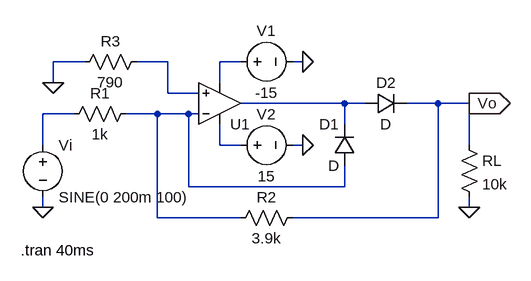
[diagram p0: schematic Run_1.asc]
Run_1.asc, the LTspice schematic file:
Version 4
SHEET 1 880 680
WIRE 80 32 32 32
WIRE 208 32 160 32
WIRE 320 32 288 32
WIRE 416 32 400 32
WIRE 32 64 32 32
WIRE 288 64 288 32
WIRE 208 80 208 32
WIRE 256 80 208 80
WIRE 480 96 320 96
WIRE 512 96 480 96
WIRE 624 96 576 96
WIRE 672 96 624 96
WIRE 64 112 16 112
WIRE 192 112 144 112
WIRE 240 112 192 112
WIRE 256 112 240 112
WIRE 480 128 480 96
WIRE 16 160 16 112
WIRE 288 160 288 128
WIRE 320 160 288 160
WIRE 416 160 400 160
WIRE 672 160 672 96
WIRE 240 224 240 112
WIRE 480 224 480 192
WIRE 480 224 240 224
WIRE 16 256 16 240
WIRE 672 256 672 240
WIRE 192 272 192 112
WIRE 320 272 192 272
WIRE 624 272 624 96
WIRE 624 272 400 272
FLAG 416 32 0
FLAG 416 160 0
FLAG 16 256 0
FLAG 32 64 0
FLAG 672 256 0
FLAG 672 96 Vo
IOPIN 672 96 Out
SYMBOL OpAmps\\UniversalOpamp2 288 96 M180
SYMATTR InstName U1
SYMBOL voltage 304 32 R270
WINDOW 0 32 56 VTop 2
WINDOW 3 -32 56 VBottom 2
WINDOW 123 0 0 Left 0
WINDOW 39 0 0 Left 0
SYMATTR InstName V1
SYMATTR Value -15
SYMBOL voltage 304 160 R270
WINDOW 0 32 56 VTop 2
WINDOW 3 -32 56 VBottom 2
WINDOW 123 0 0 Left 0
WINDOW 39 0 0 Left 0
SYMATTR InstName V2
SYMATTR Value 15
SYMBOL diode 496 192 R180
WINDOW 0 24 64 Left 2
WINDOW 3 24 0 Left 2
SYMATTR InstName D1
SYMBOL diode 512 112 R270
WINDOW 0 32 32 VTop 2
WINDOW 3 0 32 VBottom 2
SYMATTR InstName D2
SYMBOL res 416 256 R90
WINDOW 0 0 56 VBottom 2
WINDOW 3 32 56 VTop 2
SYMATTR InstName R2
SYMATTR Value 3.9k
SYMBOL res 160 96 R90
WINDOW 0 0 56 VBottom 2
WINDOW 3 32 56 VTop 2
SYMATTR InstName R1
SYMATTR Value 1k
SYMBOL voltage 16 144 R0
WINDOW 123 0 0 Left 0
WINDOW 39 0 0 Left 0
SYMATTR InstName Vi
SYMATTR Value SINE(0 200m 100)
SYMBOL res 176 16 R90
WINDOW 0 0 56 VBottom 2
WINDOW 3 32 56 VTop 2
SYMATTR InstName R3
SYMATTR Value 790
SYMBOL res 656 144 R0
SYMATTR InstName RL
SYMATTR Value 10k
TEXT -18 322 Left 2 !.tran 40ms

The netlist it stands for:
* Run_1.asc
XU1 N001 N005 N006 N002 N003 level.2 Avol=1Meg GBW=10Meg Slew=10Meg ilimit=25m rail=0 Vos=0 phimargin=45 en=0 enk=0 in=0 ink=0 Rin=500Meg  ; pins IN+ IN- V+ V- OUT
V1 N002 0 -15
V2 N006 0 15
D1 N005 N003 D
D2 N003 Vo D
R2 Vo N005 3.9k
R1 N005 N004 1k
Vi N004 0 SINE(0 200m 100)
R3 N001 0 790
RL Vo 0 10k
.model D D
.lib standard.dio
.tran 40ms
.lib UniversalOpamps2.sub
.backanno
.end